# Altium schematic sheet Shutdown_2019_v1.1_BrakeLight.SchDoc: Shutdown_2019_v1.1
size 453 x 301 mm; Date: 1/4/2019 10:42:18 PM; SheetNumber: 4; GateName_1: G$1; SymbolName_1: FRAME_B_L; LibraryName: frames; DeviceSetName: FRAME_B_L; GateName_2: G$2; SymbolName_2: DOCFIELD
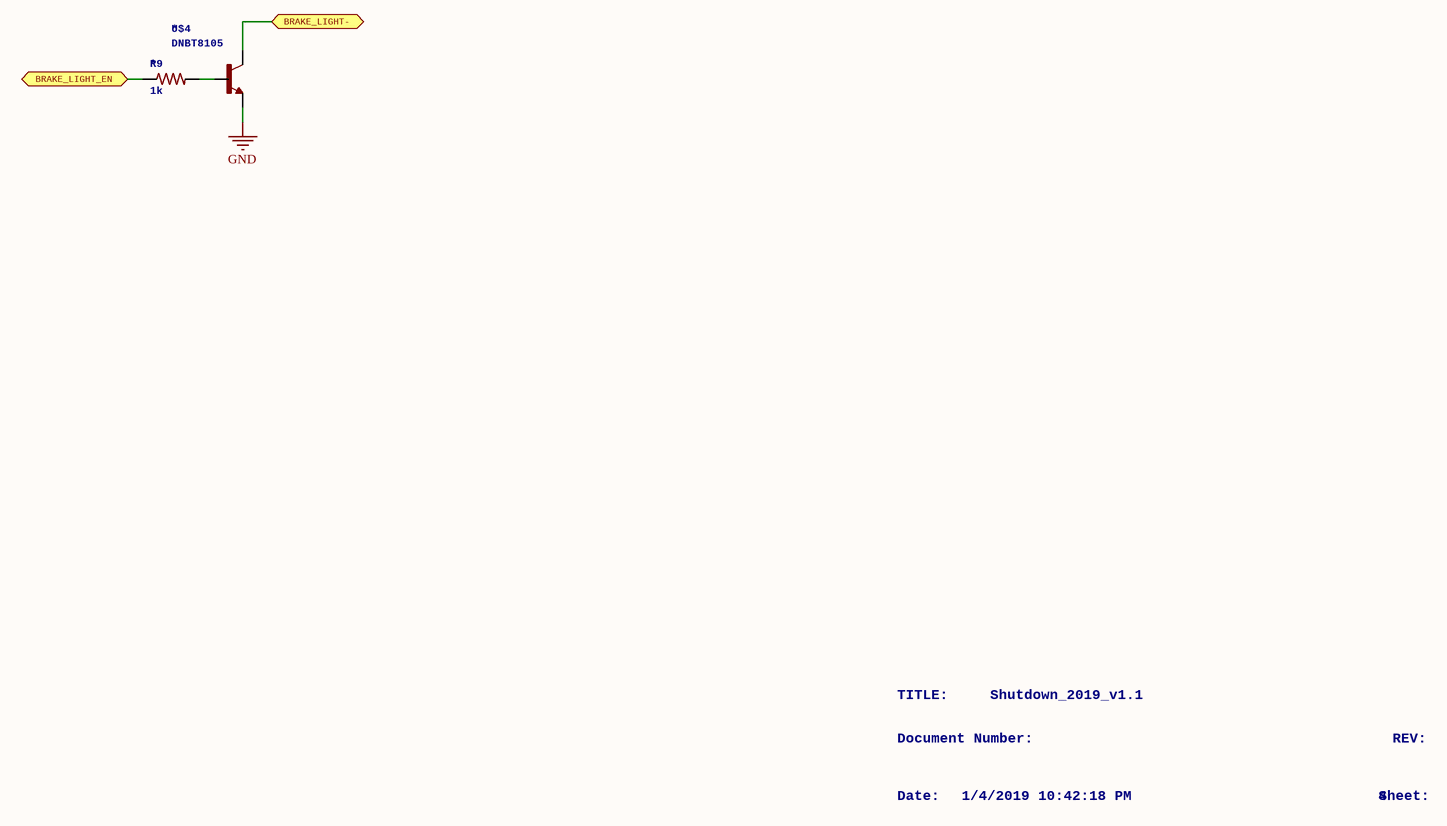
[diagram p0: Shutdown_2019_v1.1_BrakeLight.SchDoc]

## Parts
R9  1k  [R0603]
U$4  DNBT8105  [SOT23-3]

## Ports
BRAKE_LIGHT-, BRAKE_LIGHT_EN

## Nets
GND: U$4.2(E)
BRAKE_LIGHT-: U$4.3(C) ; port BRAKE_LIGHT-
BRAKE_LIGHT_EN: R9.1 ; port BRAKE_LIGHT_EN
NetR9_2: R9.2 U$4.1(B)

## Notes on the sheet
- TITLE:
- Document Number:
- Shutdown_2019_v1.1
- REV:
- Date:
- 1/4/2019 10:42:18 PM
- Sheet:
- 4
- 1
- 2
- 3
- 5
- 6
- 7
- 8
- 9
- A
- B
- C
- D
- E
- F

## Library data of the parts
R9 = R-US_R0603: RESISTOR, American symbol; GateName_1: G$1; SymbolName_1: R-US; DeviceSetName: R-US_; DeviceName: R0603; LibraryName: rcl; NAME: *; SPICEPREFIX: R
U$4 = DNBT8105: DNBT8105 Diodes Inc 1A NPN SURFACE MOUNT TRANSISTOR  Vce = 60V, Ice = 1A, h=100, Vbe = 1.1V https://www.diodes.com/assets/Datasheets/ds30513.pdf; GateName_1: G$1; SymbolName_1: NPN; LibraryName: DIODES_INC; DeviceSetName: DNBT8105; NAME: *